# EAGLE schematic Arduino Lego Tank (EAGLE 6.4)
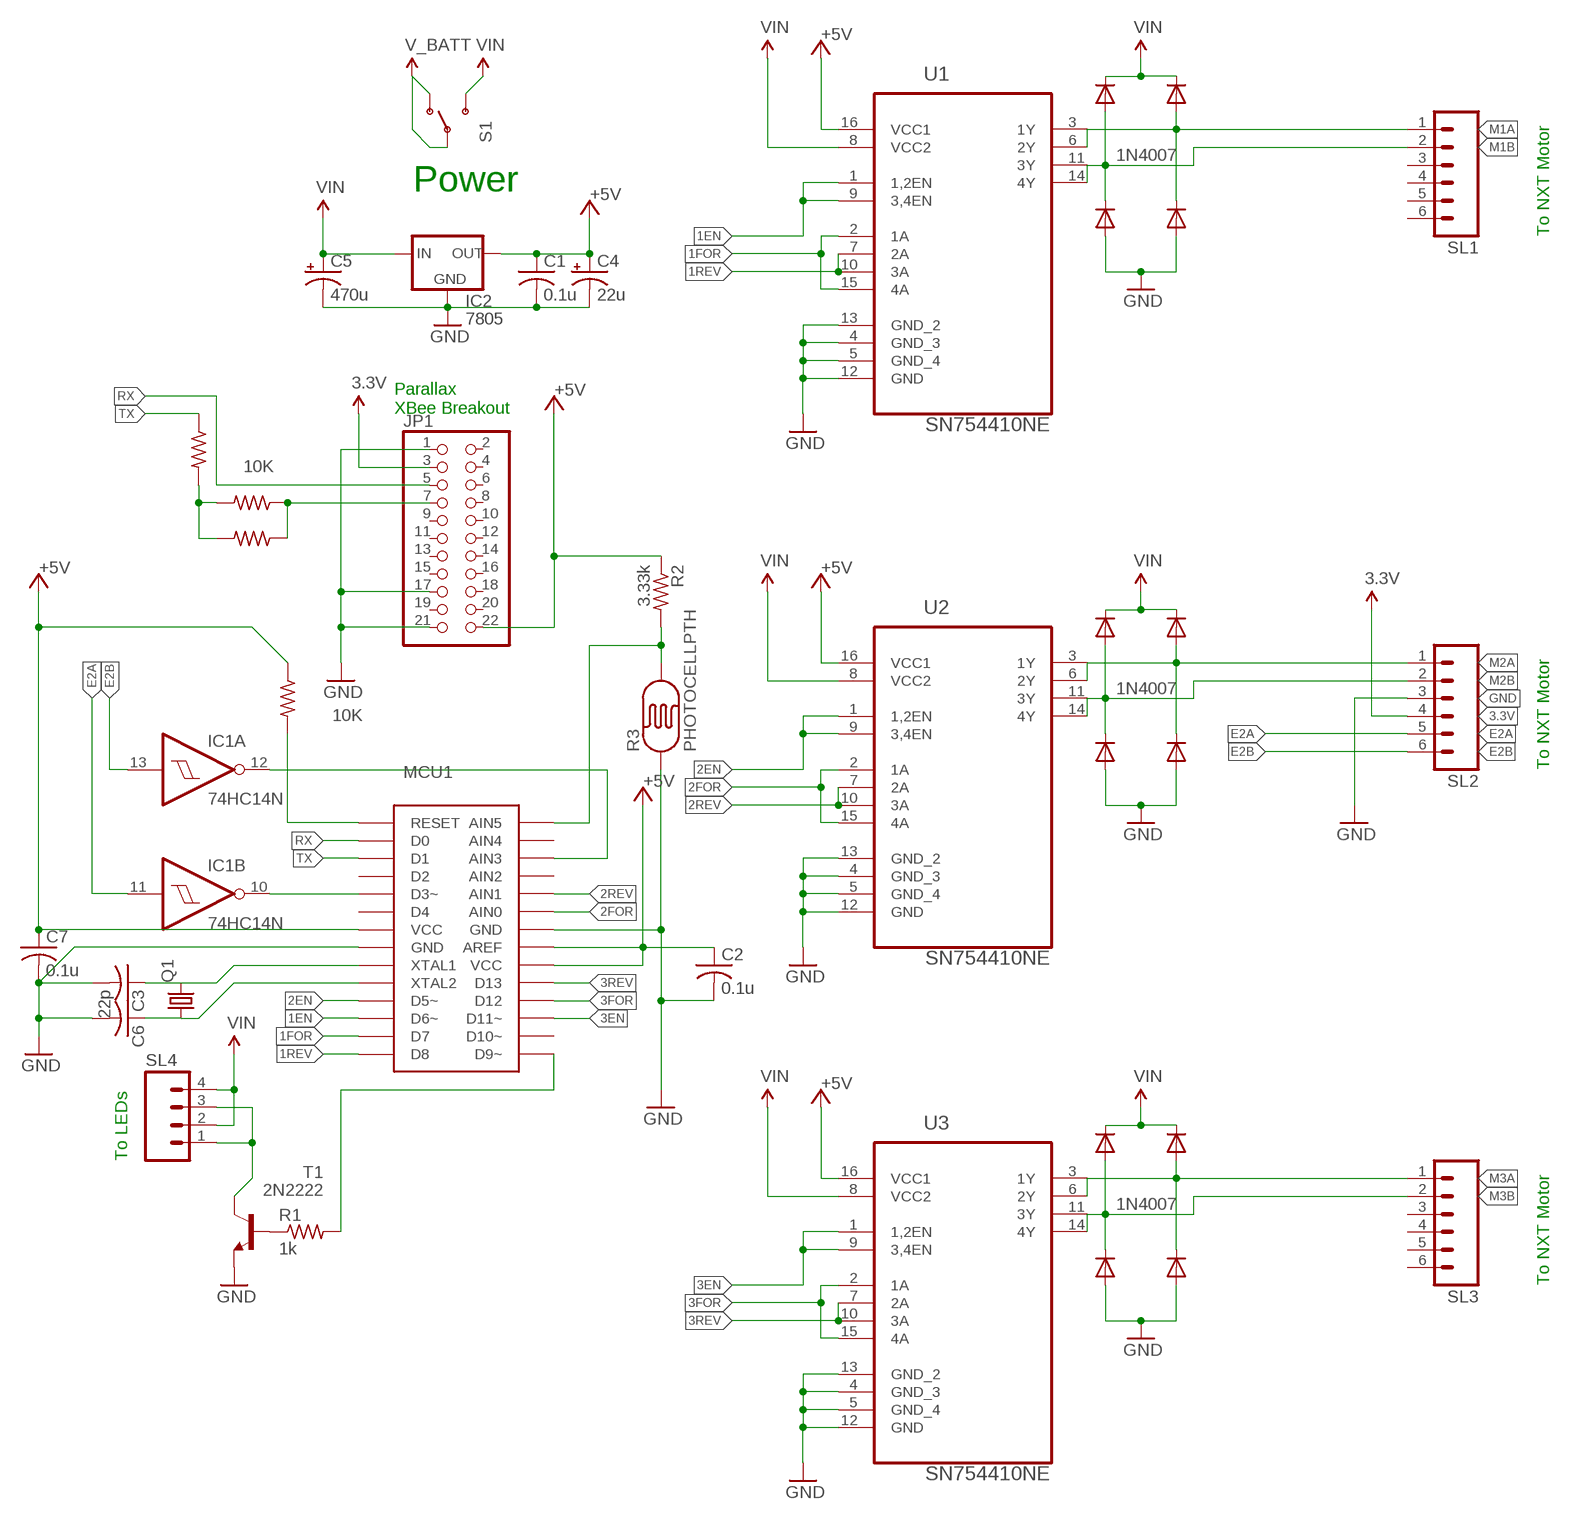
[diagram p0: schematic, sheet 1]

## Parts
C1  0.1u  C-US025-025X050  [C025-025X050]
C2  0.1u  C-US025-025X050  [C025-025X050]
C3  22p  C-US025-025X050  [C025-025X050]
C4  22u  CPOL-USE2.5-6  [E2,5-6]
C5  470u  CPOL-USE2.5-6  [E2,5-6]
C6  C-US025-025X050  [C025-025X050]
C7  0.1u  C-US025-025X050  [C025-025X050]
D1  1N4007  1N4004  [DO41-10]
D2  1N4007  1N4004  [DO41-10]
D3  1N4007  1N4004  [DO41-10]
D4  1N4007  1N4004  [DO41-10]
D5  1N4007  1N4004  [DO41-10]
D6  1N4007  1N4004  [DO41-10]
D7  1N4007  1N4004  [DO41-10]
D8  1N4007  1N4004  [DO41-10]
D9  1N4007  1N4004  [DO41-10]
D10  1N4007  1N4004  [DO41-10]
D11  1N4007  1N4004  [DO41-10]
D12  1N4007  1N4004  [DO41-10]
IC1  74HC14N  [DIL14]
IC2  7805  V_REG_78XXSINK  [TO220-IGO]
JP1  PINHD-2X11  [2X11]
MCU1  ATMEGA328P  [ATMEGA328P]
Q1  CRYSTALHC49S  [HC49/S]
R1  1k  R-US_0204/7  [0204/7]
R2  3.33k  R-US_0204/7  [0204/7]
R3  PHOTOCELLPTH  [PHOTOCELL]
R4  R-US_0204/7  [0204/7]
R5  coy  R-US_0204/7  [0204/7]
R6  10K  R-US_0204/7  [0204/7]
R7  10K  R-US_0204/7  [0204/7]
S1  SWITCH-SPDTKIT  [SWITCH-SPDT_KIT]
SL1  M06  [06P]
SL2  M06  [06P]
SL3  M06  [06P]
SL4  M04  [04P]
T1  2N2222  [TO92-EBC-OVAL]
U1  SN754410NE  [DIP254P762X508-16]
U2  SN754410NE  [DIP254P762X508-16]
U3  SN754410NE  [DIP254P762X508-16]

## Nets
1EN: MCU1.D6~ U1.1(1,2EN) U1.9(3,4EN)
1FOR: MCU1.D7 U1.2(1A) U1.15(4A)
1REV: MCU1.D8 U1.7(2A) U1.10(3A)
2EN: MCU1.D5~ U2.1(1,2EN) U2.9(3,4EN)
2FOR: MCU1.AIN0 U2.2(1A) U2.15(4A)
2REV: MCU1.AIN1 U2.7(2A) U2.10(3A)
3.3V: JP1.3 SL2.4
3EN: MCU1.D11~ U3.1(1,2EN) U3.9(3,4EN)
3FOR: MCU1.D12 U3.2(1A) U3.15(4A)
3REV: MCU1.D13 U3.7(2A) U3.10(3A)
+5V: C1.1 C2.1 C4.+ C7.1 IC2.OUT JP1.22 MCU1.AREF MCU1.VCC MCU1.VCC2(VCC) R2.1 R7.1 U1.16(VCC1) U2.16(VCC1) U3.16(VCC1)
E2A: IC1.11(B:I) SL2.5
E2B: IC1.13(A:I) SL2.6
GND: C1.2 C2.2 C3.2 C4.- C5.- C6.2 C7.2 D3.A D4.A D7.A D8.A D11.A D12.A IC2.GND JP1.1 JP1.17 JP1.21 MCU1.GND MCU1.GND1(GND) R3.1 SL2.3 T1.E U1.4(GND_3) U1.5(GND_4) U1.12(GND) U1.13(GND_2) U2.4(GND_3) U2.5(GND_4) U2.12(GND) U2.13(GND_2) U3.4(GND_3) U3.5(GND_4) U3.12(GND) U3.13(GND_2)
M1A: D2.A D4.C SL1.1 U1.3(1Y) U1.6(2Y)
M1B: D1.A D3.C SL1.2 U1.11(3Y) U1.14(4Y)
M2A: D6.A D8.C SL2.1 U2.3(1Y) U2.6(2Y)
M2B: D5.A D7.C SL2.2 U2.11(3Y) U2.14(4Y)
M3A: D10.A D12.C SL3.1 U3.3(1Y) U3.6(2Y)
M3B: D9.A D11.C SL3.2 U3.11(3Y) U3.14(4Y)
N$13: R1.1 T1.B
N$14: SL4.1 SL4.3 T1.C
N$15: MCU1.D9~ R1.2
N$17: R4.2 R5.2 R6.2
N$18: JP1.7 R4.1 R5.1
N$24: IC1.12(A:O) MCU1.AIN3
N$25: IC1.10(B:O) MCU1.D3~
N$26: MCU1.RESET R7.2
N$27: MCU1.AIN5 R2.2 R3.2
N$29: C6.1 MCU1.XTAL2 Q1.1
N$30: C3.1 MCU1.XTAL1 Q1.2
RX: JP1.5 MCU1.D0
TX: MCU1.D1 R6.1
V_BATT: S1.1(O) S1.2(P)
VIN: C5.+ D1.C D2.C D5.C D6.C D9.C D10.C IC2.IN S1.3(S) SL4.2 SL4.4 U1.8(VCC2) U2.8(VCC2) U3.8(VCC2)
Unconnected: IC1.1(D:I) IC1.2(D:O) IC1.3(E:I) IC1.4(E:O) IC1.5(F:I) IC1.6(F:O) IC1.8(C:O) IC1.9(C:I) JP1.2 JP1.4 JP1.6 JP1.8 JP1.9 JP1.10 JP1.11 JP1.12 JP1.13 JP1.14 JP1.15 JP1.16 JP1.18 JP1.19 JP1.20 MCU1.AIN2 MCU1.AIN4 MCU1.D2 MCU1.D4 MCU1.D10~ SL1.3 SL1.4 SL1.5 SL1.6 SL3.3 SL3.4 SL3.5 SL3.6

## Notes on the sheet
- Power
- To NXT Motor
- Parallax
  XBee Breakout
- To NXT Motor
- To LEDs
- To NXT Motor

## Power pins joined to a net without a drawn wire
GND: IC1.7(P:GND)
VCC: IC1.14(P:VCC)

## Library data of the parts
C1-C3 C6 C7 = adafruit:C-US: CAPACITOR, American symbol
C4 C5 = rcl:CPOL-US: POLARIZED CAPACITOR, American symbol
D1-D12 = diode:1N4004: DIODE general purpose rectifier, 1 A
IC1 = 74xx-eu:74*14: Hex schmitt trigger INVERTER
IC2 = SparkFun-PowerIC:V_REG_78XX: Voltage Regulator Standard 7805 5V regulator. IGO (Input Ground Output). Spark Fun Electronics SKU : COM-00107
JP1 = pinhead:PINHD-2X11: PIN HEADER
MCU1 = ATMEGA328P:ATMEGA328P: A very simple microcontroller that can be used for low power embedded applications
Q1 = crystal:CRYSTAL: CRYSTAL; OC_FARNELL: 1667008; OC_NEWARK: unknown
R1 R2 R4-R7 = resistor:R-US_: RESISTOR, American symbol
R3 = SparkFun-Sensors:PHOTOCELL: CdS photoresistor. This is a low cost way to detect light levels. Resistance decreases with more incoming light. SparkFun SKU: SEN-09088
S1 = SparkFun-Electromechanical:SWITCH-SPDT: SPDT Switch Simple slide switch, Spark Fun Electronics SKU : COM-00102 DPDT SMT slide switch, AYZ0202, SWCH-08179
SL1-SL3 = con-amp-quick:M06: AMP QUICK CONNECTOR; OC_FARNELL: unknown; OC_NEWARK: unknown
SL4 = con-amp-quick:M04: AMP QUICK CONNECTOR; OC_FARNELL: unknown; OC_NEWARK: unknown
T1 = adafruit:2N2222: NPN TRANSISTOR Big oval pads
U1-U3 = Texas Instruments_By_element14_Batch_1:SN754410NE: QUADRUPLE HALF-H DRIVERS; MPN: SN754410NE; OC_FARNELL: 1470411; OC_NEWARK: 08F8145; PACKAGE: PDIP-16; SUPPLIER: Texas Instruments